# EAGLE design flying-horse-foot-v3.1 (EAGLE 9.6.2)
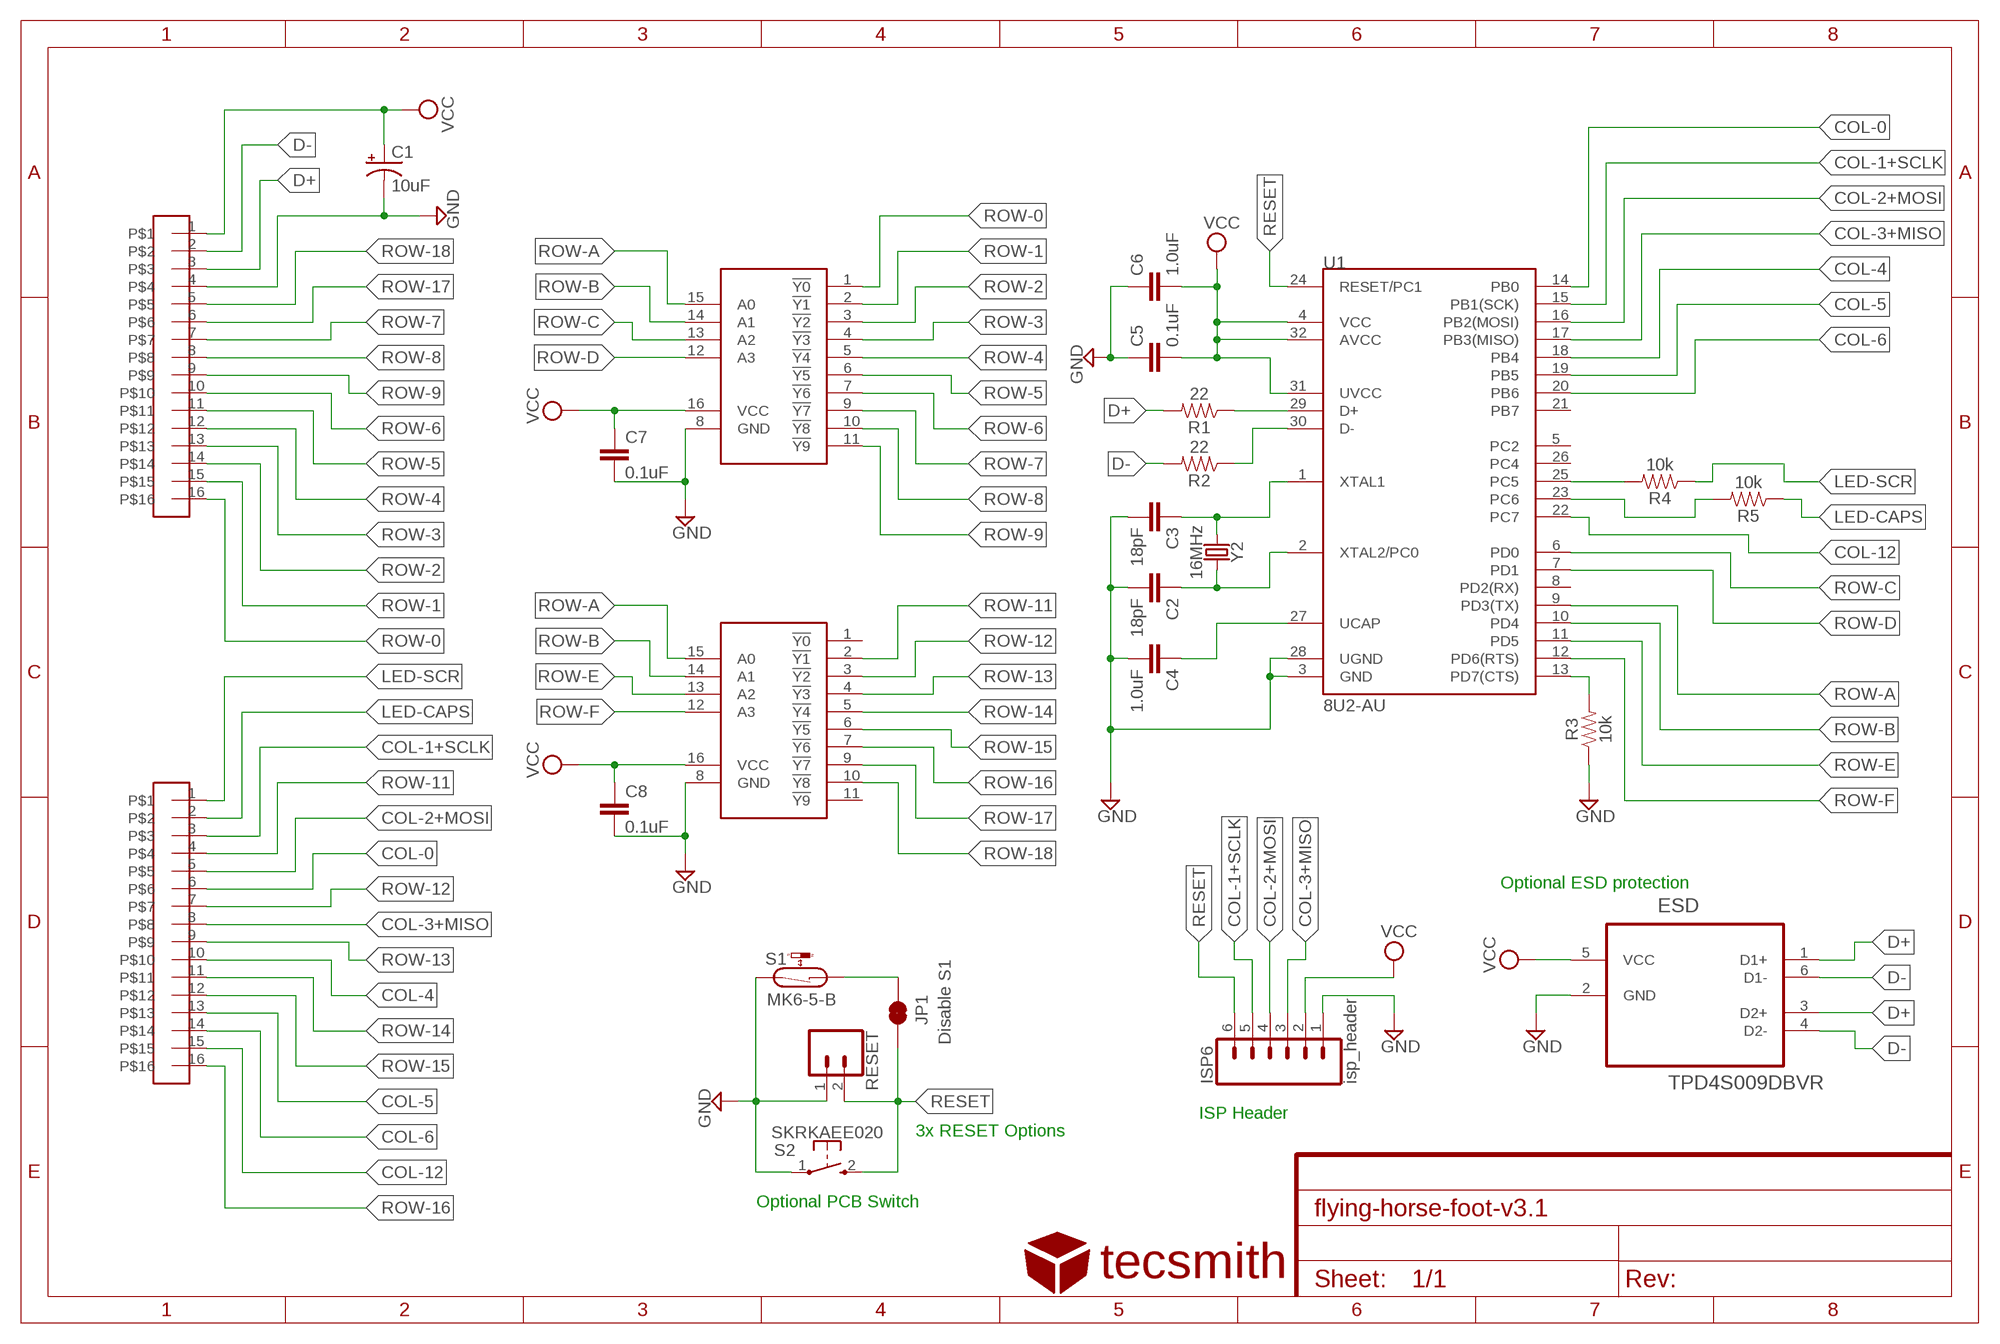
[diagram p0: schematic, sheet 1]

## Parts
C1  10uF  EEE-1CA100SR-EIA3528-20V-10%(TANT)  [EEE-1CA100SR]
C2  18pF  18PF-0603-50V-5%  [0603]
C3  18pF  18PF-0603-50V-5%  [0603]
C4  1.0uF  1.0UF-0603-16V-10%  [0603]
C5  0.1uF  0.1UF-0603-25V-5%  [0603]
C6  1.0uF  1.0UF-0603-16V-10%  [0603]
C7  0.1uF  0.1UF-0603-25V-5%  [0603]
C8  0.1uF  0.1UF-0603-25V-5%  [0603]
ESD  TPD4S009DBVR  [SOT95P280X145-6N]
ISP6  isp_header  CONN_06NO_SILK_NO_POP  [1X06_NO_SILK]
JP1  Disable S1  JUMPER-SMT_2_NC_TRACE_NO-SILK  [SMT-JUMPER_2_NC_TRACE_NO-SILK]
R1  22  22OHM-0603-1/10W-1%  [0603]
R2  22  22OHM-0603-1/10W-1%  [0603]
R3  10k  10KOHM-0603-1/10W-1%  [0603]
R4  10k  10KOHM-0603-1/10W-1%  [0603]
R5  10k  10KOHM-0603-1/10W-1%  [0603]
RESET  0.1 inch 2-pin  CONN_02  [1X02]
S1  MK6-5-B  REED-SWITCH-MK6-5-B  [MK6-5]
S2  SKRKAEE020  MOMENTARY-SWITCH-SPST-1  [SKRKAEE020]
U1  8U2-AU  ATMEGA8U2AU  [TQFP32-08_MCU]
U$1  SN74HC42DR  74HC42D16  [D16]
U$2  74HC42D16  [D16]
U$3  16PIN-2MM-HEADER  [16PIN-2MM-HEADER]
U$4  16PIN-2MM-HEADER  [16PIN-2MM-HEADER]
U$5  TECSMITH-LOGO  [TECSMITH-LOGO]
Y2  16MHz  CRYSTAL-16MHZSMD-5X3.2  [CRYSTAL-SMD-5X3.2-4PAD]

## Nets
COL-0: U1.14(PB0) U$4.6
COL-1+SCLK: ISP6.5 U1.15(PB1(SCK)) U$4.3
COL-2+MOSI: ISP6.4 U1.16(PB2(MOSI)) U$4.5
COL-3+MISO: ISP6.3 U1.17(PB3(MISO)) U$4.8
COL-4: U1.18(PB4) U$4.10
COL-5: U1.19(PB5) U$4.13
COL-6: U1.20(PB6) U$4.14
COL-12: U1.22(PC7) U$4.15
D+: ESD.1(D1+) ESD.3(D2+) R1.2 U$3.3
D-: ESD.4(D2-) ESD.6(D1-) R2.2 U$3.2
GND: C1.- C2.2 C3.2 C4.2 C5.1 C6.1 C7.2 C8.2 ESD.2(GND) ISP6.1 R3.1 RESET.1 S1.2 S2.1 U1.3(GND) U1.28(UGND) U$1.8(GND) U$2.8(GND) U$3.4
HWB: R3.2 U1.13(PD7(CTS))
LED-CAPS: R5.1 U$4.2
LED-SCR: R4.1 U$4.1
N$1: R1.1 U1.29(D+)
N$2: R2.1 U1.30(D-)
N$3: C2.1 U1.2(XTAL2/PC0) Y2.3
N$4: C3.1 U1.1(XTAL1) Y2.1
N$5: R4.2 U1.25(PC5)
N$6: C4.1 U1.27(UCAP)
N$7: R5.2 U1.23(PC6)
N$8: JP1.1 S1.1
RESET: ISP6.6 JP1.2 RESET.2 S2.2 U1.24(RESET/PC1)
ROW-0: U$1.1(!Y0) U$3.16
ROW-1: U$1.2(!Y1) U$3.15
ROW-2: U$1.3(!Y2) U$3.14
ROW-3: U$1.4(!Y3) U$3.13
ROW-4: U$1.5(!Y4) U$3.12
ROW-5: U$1.6(!Y5) U$3.11
ROW-6: U$1.7(!Y6) U$3.10
ROW-7: U$1.9(!Y7) U$3.7
ROW-8: U$1.10(!Y8) U$3.8
ROW-9: U$1.11(!Y9) U$3.9
ROW-11: U$2.2(!Y1) U$4.4
ROW-12: U$2.3(!Y2) U$4.7
ROW-13: U$2.4(!Y3) U$4.9
ROW-14: U$2.5(!Y4) U$4.11
ROW-15: U$2.6(!Y5) U$4.12
ROW-16: U$2.7(!Y6) U$4.16
ROW-17: U$2.9(!Y7) U$3.6
ROW-18: U$2.10(!Y8) U$3.5
ROW-A: U1.9(PD3(TX)) U$1.15(A0) U$2.15(A0)
ROW-B: U1.10(PD4) U$1.14(A1) U$2.14(A1)
ROW-C: U1.6(PD0) U$1.13(A2)
ROW-D: U1.7(PD1) U$1.12(A3)
ROW-E: U1.11(PD5) U$2.13(A2)
ROW-F: U1.12(PD6(RTS)) U$2.12(A3)
VCC: C1.+ C5.2 C6.2 C7.1 C8.1 ESD.5(VCC) ISP6.2 U1.4(VCC) U1.31(UVCC) U1.32(AVCC) U$1.16(VCC) U$2.16(VCC) U$3.1
Unconnected: U1.5(PC2) U1.8(PD2(RX)) U1.21(PB7) U1.26(PC4) U$2.1(!Y0) U$2.11(!Y9)

## Notes on the sheet
- Optional ESD protection
- ISP Header
- 3x RESET Options
- Optional PCB Switch

## Library data of the parts
C1 = aaa2:EEE-1CA100SR: 10.0µF polarized capacitors A capacitor is a passive two-terminal electrical component used to store electrical energy temporarily in an electric field.; PROD_ID: CAP-08063
C2 C3 = SparkFun-Capacitors:18PF: 18pF ceramic capacitors A capacitor is a passive two-terminal electrical component used to store electrical energy temporarily in an electric field.; PROD_ID: CAP-08267
C4 C6 = SparkFun-Capacitors:1.0UF: 1µF ceramic capacitors A capacitor is a passive two-terminal electrical component used to store electrical energy temporarily in an electric field.; PROD_ID: CAP-00868
C5 C7 C8 = SparkFun-Capacitors:0.1UF: 0.1µF ceramic capacitors A capacitor is a passive two-terminal electrical component used to store electrical energy temporarily in an electric field.; PROD_ID: CAP-08604
ESD = Texas Instruments_By_element14_Batch_1:TPD4S009DBVR: 4-CHANNEL ESD SOLUTION FOR HIGH-SPEED DIFFERENTIAL INTERFACE; MPN: TPD4S009DBVR; OC_FARNELL: 1855143; OC_NEWARK: 33R2191; PACKAGE: SOT-23-6; SUPPLIER: TEXAS INSTRUMENTS
ISP6 = SparkFun-Connectors:CONN_06: Multi connection point. Often used as Generic Header-pin footprint for 0.1 inch spaced/style header connections On any of the 0.1 inch spaced packages, you can populate with these: Break Away Headers - Straight <https://www.sparkfun.com/products/116> (PRT-00116) Break Away Male Headers - Right Angle <https://www.sparkfun.com/products/553> (PRT-00553) Female Headers <https://www.sparkfun.com/products/115> (PRT-00115) Break Away Headers - Machine Pin <https://www.sparkfun.com/products/117> (PRT-00117) Break Away Female Headers - Swiss Machine Pin <https://www.sparkfun.com/products/743> (PRT-00743) Arduino Stackable Header - 6 Pin <https://www.sparkfun.com/products/9280> (PRT-09280) For SCREWTERMINALS and SPRING TERMINALS visit here: Screw Terimnals on SparkFun.com <https://www.sparkfun.com/search/results?term=Screw+Terminals> (5mm/3.5mm/2.54mm spacing) This device is also useful as a general connection point to wire up your design to another part of your project. Our various solder wires solder well into these plated through hole pads. Hook-Up Wire - Assortment (Stranded, 22 AWG) <https://www.sparkfun.com/products/11375> (PRT-11375) Hook-Up Wire - Assortment (Solid Core, 22 AWG) <https://www.sparkfun.com/products/11367> (PRT-11367) View the entire wire category on our website here <https://www.sparkfun.com/categories/141>
JP1 = SparkFun-Jumpers:JUMPER-SMT_2_NC_TRACE: Normally closed trace jumper This jumper has a trace between two pads so it's normally closed (NC). Use a razor knife to open the connection. For best results follow the IPC guidelines for cutting traces: Cutout at least 0.063 mm (0.005 in). Remove all loose material to clean up the cut area. Seal the cut with an approved epoxy. Reapply solder to reclose the connection.
R1 R2 = SparkFun-Resistors:22OHM: 22Ω resistor A resistor is a passive two-terminal electrical component that implements electrical resistance as a circuit element. Resistors act to reduce current flow, and, at the same time, act to lower voltage levels within circuits. - Wikipedia; PROD_ID: RES-08698
R3-R5 = SparkFun-Resistors:10KOHM: 10kΩ resistor A resistor is a passive two-terminal electrical component that implements electrical resistance as a circuit element. Resistors act to reduce current flow, and, at the same time, act to lower voltage levels within circuits. - Wikipedia; PROD_ID: RES-00824
RESET = SparkFun-Connectors:CONN_02: Multi connection point. Often used as Generic Header-pin footprint for 0.1 inch spaced/style header connections On any of the 0.1 inch spaced packages, you can populate with these: Break Away Headers - Straight <https://www.sparkfun.com/products/116> (PRT-00116) Break Away Male Headers - Right Angle <https://www.sparkfun.com/products/553> (PRT-00553) Female Headers <https://www.sparkfun.com/products/115> (PRT-00115) Break Away Headers - Machine Pin <https://www.sparkfun.com/products/117> (PRT-00117) Break Away Female Headers - Swiss Machine Pin <https://www.sparkfun.com/products/743> (PRT-00743) For SCREWTERMINALS and SPRING TERMINALS visit here: Screw Terimnals on SparkFun.com <https://www.sparkfun.com/search/results?term=Screw+Terminals> (5mm/3.5mm/2.54mm spacing) This device is also useful as a general connection point to wire up your design to another part of your project. Our various solder wires solder well into these plated through hole pads. Hook-Up Wire - Assortment (Stranded, 22 AWG) <https://www.sparkfun.com/products/11375> (PRT-11375) Hook-Up Wire - Assortment (Solid Core, 22 AWG) <https://www.sparkfun.com/products/11367> (PRT-11367) View the entire wire category on our website here <https://www.sparkfun.com/categories/141> Special notes: Molex polarized connector foot print use with: PRT-08233 with associated crimp pins and housings. 2.54_SCREWTERM for use with PRT-10571. 3.5mm Screw Terminal footprints for PRT-08084 5mm Screw Terminal footprints for use with PRT-08432
S1 = switch-reed:REED-SWITCH-: Reed Sensor; MF: MEDER; MPN: MK6-5-B; OC_FARNELL: 1079479
S2 = SilvinoR_Custom_Eagle:MOMENTARY-SWITCH-SPST-1: Momentary Switch (Pushbutton) - SPST - Two Circuits Normally-open (NO) SPST momentary switches (buttons, pushbuttons). Schematic symbol includes two switch circuits. Variants SMD-4.6MMX2.8MM - 4.60mm x 2.80mm Tactile Momentary Button Switch - Used on SparkFun SAMD21 Mini Breakout <https://www.sparkfun.com/products/13664> SMD-5.2MM - Mini Pushbutton Switch - SMD <https://www.sparkfun.com/products/8720> - Used on Arduino Pro Mini <https://www.sparkfun.com/products/11114>
U1 = SparkFun-Retired:ATMEGA8U2: Atmel 32-pin 8-bit Microcontroller with 8/16/32K Bystes of ISP Flash and USB Controller. ATmega8U2, ATmega16U2, and ATmega32U2 Datasheet SparkFun Products Storefront component: ATMEGA8U2-AU <https://www.sparkfun.com/products/13703> (COM-13703); PROD_ID: IC-10104
U$1 U$2 = aaa2:74HC42
U$3 U$4 = aaa2:16PIN-2MM-HEADER
U$5 = SilvinoR_Custom_Eagle:TECSMITH-LOGO
Y2 = SparkFun-Clocks:CRYSTAL-16MHZ: 16MHz Crystal Digikey Example <http://www.digikey.com/product-search/en?keywords=535-9122-1-ND> Frequency: 16MHz Frequency Stability: ±50ppm Frequency Tolerance: ±20ppm Load Capacitance: 18pF SparkFun Products: Pro Micro -5V/16MHz <https://www.sparkfun.com/products/12640> SparkFun Serial Enabled LCD Kit <https://www.sparkfun.com/products/10097>; PROD_ID: XTAL-08218; SF_ID: COM-00094

## Board
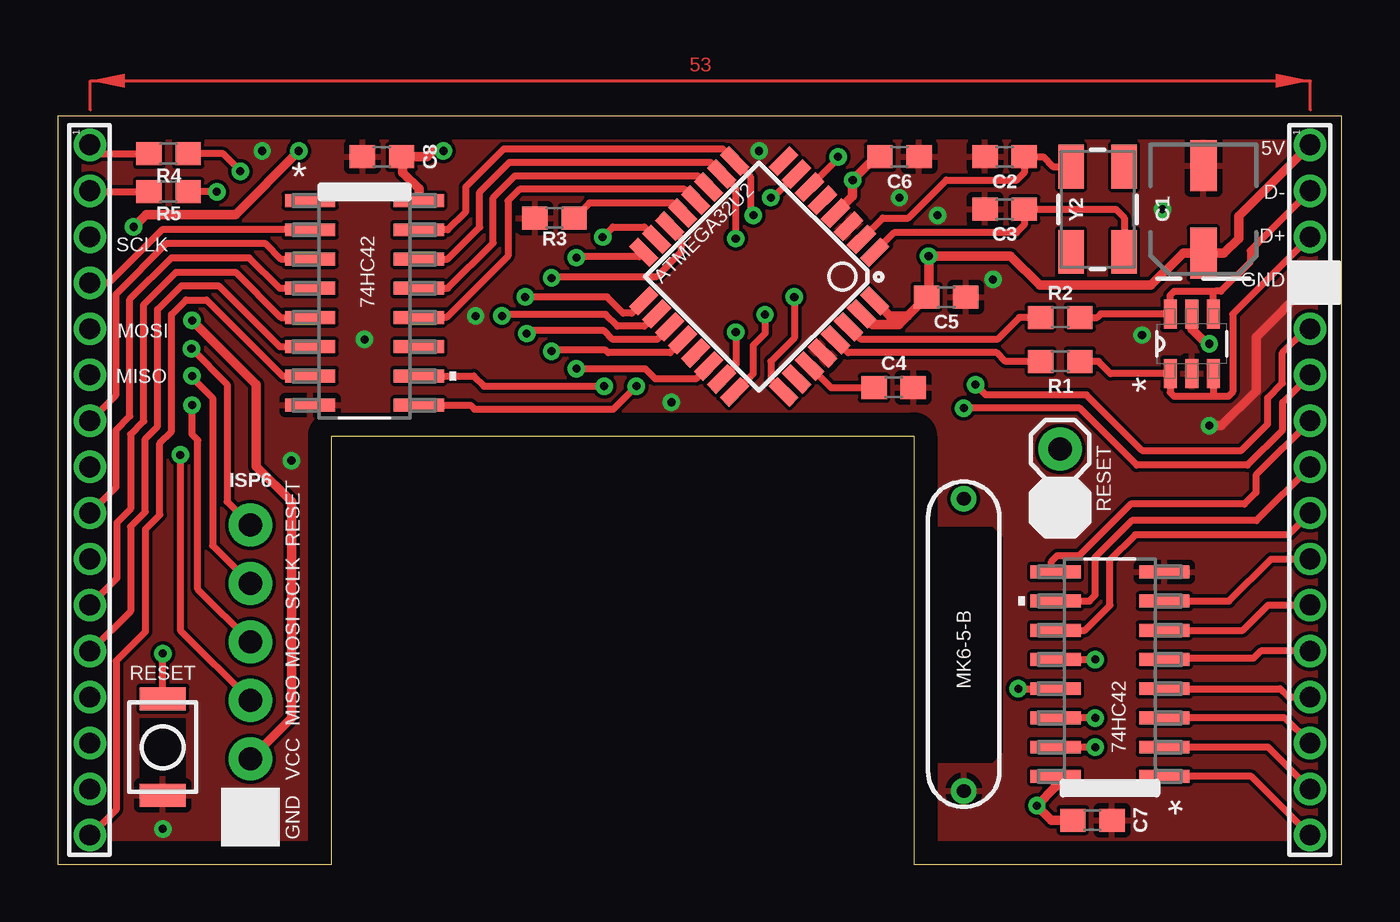
[diagram p1: board, top side]
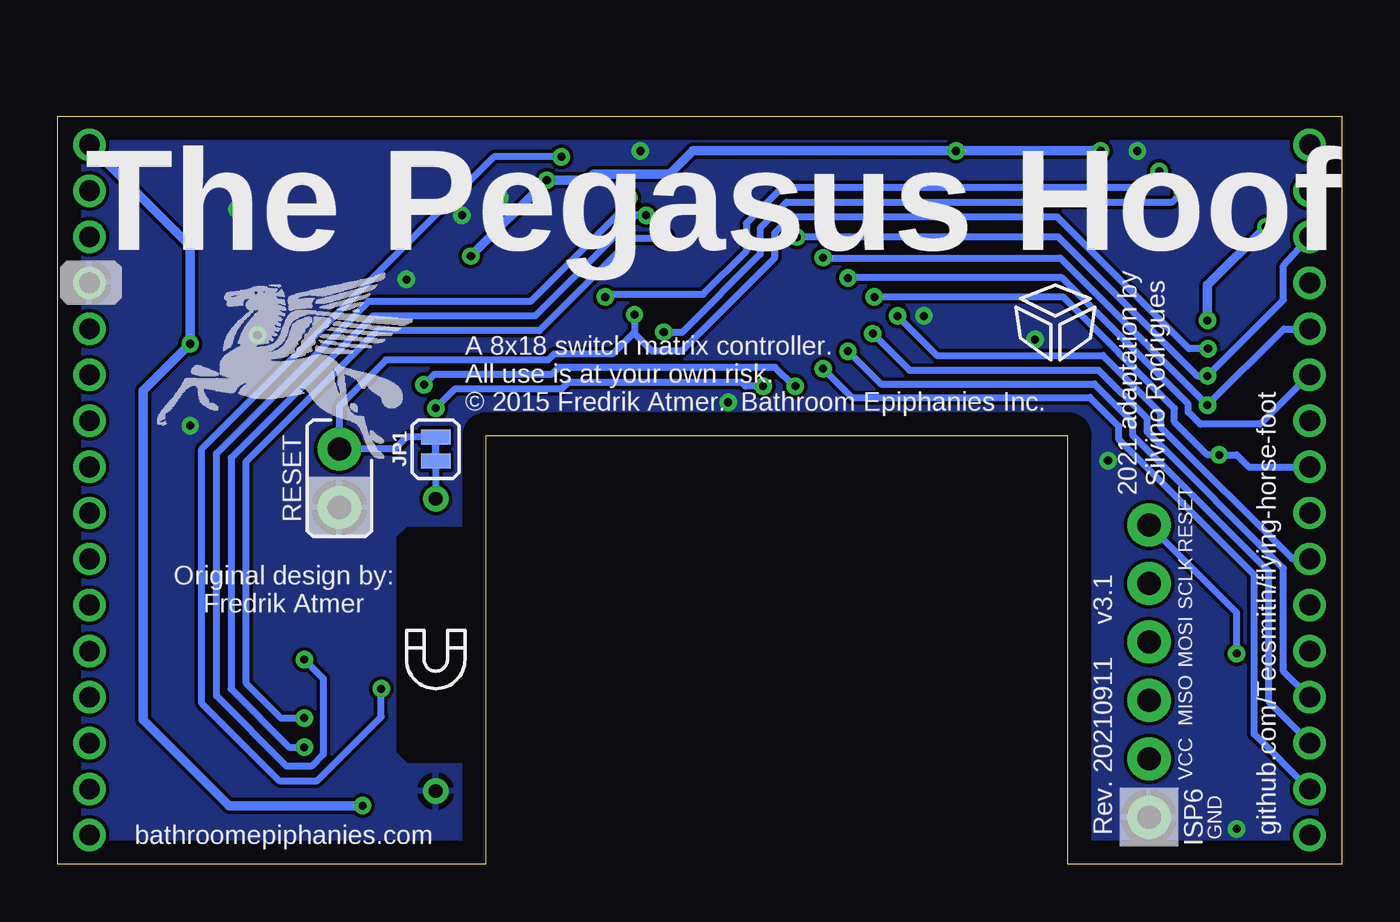
[diagram p2: board, bottom side, seen from below]

Size 55.8 x 32.5 mm. Coordinates in mm from the lower left corner, seen from the top.
Outline: 0,0 11.9,0 11.9,18.6 37.2,18.6 37.2,0 55.8,0 55.8,32.5 0,32.5 0,0
Copper layers (1*16): Top 0.035mm / dielectric 1.5mm / Bottom 0.035mm
Design rules "default": minimum track width 6mil, minimum drill 0.35mm, track to track 6mil, track to pad 6mil, pad to pad 6mil, via to via 6mil, smd to smd 6mil, copper to edge 40mil, drill to drill 6mil, minimum pad ring 10mil, minimum via ring 8mil, stop-mask expansion 4mil, vias tented up to drill 0mil, thermal gap 10mil

### Footprints (pad centres in the part's own frame; a part is rotated, then mirrored left to right if it is on the bottom)
EEE-1CA100SR = smd 1.15 x 2.2: + 0,-1.9; - 0,1.9
0603 = smd 1.1 x 1: 1 -0.85,0; 2 0.85,0
SOT95P280X145-6N = smd 1.27 x 0.559: 1 -1.295,0.94; 2 -1.295,0; 3 -1.295,-0.94; 4 1.295,-0.94; 5 1.295,0; 6 1.295,0.94
1X06_NO_SILK = drill 1.016 pad 1.88: 1 0,0; 2 2.54,0; 3 5.08,0; 4 7.62,0; 5 10.16,0; 6 12.7,0
SMT-JUMPER_2_NC_TRACE_NO-SILK = smd 0.66 x 1.27: 1 -0.521,0; 2 0.521,0
1X02 = drill 1.016 pad 1.88: 1 0,0; 2 2.54,0
MK6-5 = drill 0.6 pad 1.016: 1 -6.35,0; 2 6.35,0
SKRKAEE020 = smd 1 x 2: 1 -2.1,0; 2 2.1,0
TQFP32-08_MCU = smd 1.27 x 0.559: 1 -4.293,2.8; 2 -4.293,2; 3 -4.293,1.2; 4 -4.293,0.4; 5 -4.293,-0.4; 6 -4.293,-1.2; 7 -4.293,-2; 8 -4.293,-2.8; 17 4.293,-2.8; 18 4.293,-2; 19 4.293,-1.2; 20 4.293,-0.4; 21 4.293,0.4; 22 4.293,1.2; 23 4.293,2; 24 4.293,2.8 | smd 0.559 x 1.27: 9 -2.8,-4.293; 10 -2,-4.293; 11 -1.2,-4.293; 12 -0.4,-4.293; 13 0.4,-4.293; 14 1.2,-4.293; 15 2,-4.293; 16 2.8,-4.293; 25 2.8,4.293; 26 2,4.293; 27 1.2,4.293; 28 0.4,4.293; 29 -0.4,4.293; 30 -1.2,4.293; 31 -2,4.293; 32 -2.8,4.293
D16 = smd 2.184 x 0.559: 1 -2.362,4.445; 2 -2.362,3.175; 3 -2.362,1.905; 4 -2.362,0.635; 5 -2.362,-0.635; 6 -2.362,-1.905; 7 -2.362,-3.175; 8 -2.362,-4.445; 9 2.362,-4.445; 10 2.362,-3.175; 11 2.362,-1.905; 12 2.362,-0.635; 13 2.362,0.635; 14 2.362,1.905; 15 2.362,3.175; 16 2.362,4.445
16PIN-2MM-HEADER = drill 0.9 pad 1.27: 1 -15,-1; 2 -13,-1; 3 -11,-1; 4 -9,-1; 5 -7,-1; 6 -5,-1; 7 -3,-1; 8 -1,-1; 9 1,-1; 10 3,-1; 11 5,-1; 12 7,-1; 13 9,-1; 14 11,-1; 15 13,-1; 16 15,-1
CRYSTAL-SMD-5X3.2-4PAD = smd 1.9 x 1.1: 1 -1.85,-1.15; 2 1.85,-1.15; 3 1.85,1.15; 4 -1.85,1.15

### Placement (x,y rotation side)
C1  49.78,28.45 0 top
C2  41.15,30.73 180 top
C3  41.15,28.45 180 top
C4  36.32,20.7 0 top
C5  38.61,24.64 180 top
C6  36.58,30.73 180 top
C7  44.96,1.91 0 top
C8  14.1,30.73 180 top
ESD  49.28,22.61 90 top
ISP6  8.38,2.03 90 top
JP1  39.37,18.03 90 bottom
R1  43.56,21.84 0 top
R2  43.56,23.75 0 top
R3  21.59,28.07 0 top
R4  4.83,30.86 0 top
R5  4.83,29.21 0 top
RESET  43.56,15.49 90 top
S1  39.37,9.53 270 top
S2  4.57,5.08 90 top
U1  30.48,25.53 225 top
U$1  45.72,8.26 180 top
U$2  13.34,24.38 0 top
U$3  55.42,16.26 270 top
U$4  2.4,16.26 270 top
U$5  12.45,23.62 0 bottom
Y2  45.19,28.45 90 top

### Tracks (layer width: path | path; a pad name or v marks a point on that pad's centre or on a via)
COL-0  (via drill 0.35)
  Top 0.305: U1.14 26.6,27.7 27.11,27.18 27.11,26.61 26.04,25.53 21.53,25.53 v21.46,25.46
  Bottom 0.305: v21.46,25.46 21.45,25.48 12.18,25.48 6.68,19.98 6.68,19.64 6.16,19.11 3.56,19.11 1.41,21.26 U$4.6
COL-1+SCLK  (via drill 0.35)
  Top 0.305: U1.15 25.49,27.69 24.13,27.69 v23.69,27.24 | v5.84,21.21 5.84,21.14 6.73,20.26 6.73,13.84 ISP6.5
  Bottom 0.305: v23.69,27.24 23.67,27.26 12.33,27.26 6.29,21.21 v5.84,21.21 2.54,24.51 2.54,26 U$4.3
COL-2+MOSI  (via drill 0.35)
  Top 0.305: v22.54,26.35 22.58,26.39 25.27,26.39 U1.16 | v5.84,19.94 5.84,18.67 6.1,18.41 6.1,11.94 ISP6.4
  Bottom 0.305: v22.54,26.35 22.53,26.34 12.24,26.34 v5.84,19.94 2.52,23.26 U$4.5
COL-3+MISO  (via drill 0.35)
  Top 0.305: 25.38,24.38 U1.17 25.46,24.45 24.96,23.94 24.57,23.94 23.88,24.64 v20.32,24.64 | ISP6.3 5.33,10.16 v5.33,17.78
  Bottom 0.305: v20.32,24.64 12.11,24.64 7.27,19.8 7.27,19.21 5.84,17.78 v5.33,17.78 4.57,17.78 4.05,17.26 U$4.8
COL-4  (via drill 0.35)
  Top 0.305: U1.18 26.03,23.89 | 19.3,23.8 v19.3,23.81 19.37,23.88 23.81,23.88 24.32,23.37 25.49,23.37 U1.18 | U1.18 25.75,23.62
  Bottom 0.305: v19.3,23.81 17.59,22.1 10.38,22.1 7.86,19.57 7.86,18.97 2.16,13.27 1.41,13.27 U$4.10
COL-5  (via drill 0.35)
  Top 0.305: 26.29,23.04 U1.19 26.05,22.8 24.12,22.8 23.74,23.17 20.54,23.17 20.4,23.04 v20.38,23.05
  Bottom 0.305: v20.38,23.05 18.8,21.46 10.58,21.46 8.46,19.35 8.46,18.77 2.54,12.85 2.54,8.38 1.41,7.26 U$4.13
COL-6  (via drill 0.35)
  Top 0.305: U1.20 26.61,22.23 23.92,22.23 23.81,22.33 21.51,22.33 v21.46,22.29
  Bottom 0.305: v21.46,22.29 20.04,20.86 10.75,20.86 9.07,19.18 9.07,18.61 3.17,12.71 3.17,7.05 1.4,5.27 U$4.14
COL-12  (via drill 0.35)
  Top 0.305: U1.22 27.73,21.08 25.97,21.08 25.54,21.51 22.55,21.51 v22.54,21.53
  Bottom 0.305: v22.54,21.53 21.29,20.28 10.94,20.28 9.68,19.02 9.68,18.45 3.81,12.57 3.81,5.65 1.39,3.23 U$4.15
D+
  Top 0.305: R1.2 45.22,21.84 45.74,21.31 ESD.1 48.34,20.5 48.51,20.32 50.23,20.32 | U$3.3 51.05,23.89 51.05,20.51 50.86,20.32 50.23,20.32 | ESD.3 50.22,20.33 50.23,20.32
D-
  Top 0.305: U$3.2 51.82,26.65 51.82,26.16 50.55,24.89 50.29,24.89 | R2.2 45.17,23.75 45.33,23.9 ESD.6 48.34,24.71 48.51,24.89 50.29,24.89 | ESD.4 50.22,24.82 50.29,24.89
GND  (via drill 0.35)
  Top 0.305: 33.23,22.2 U1.28
  Top 0.406: 13.18,30.8 C8.2 13.34,30.65 | U1.3 34.38,27.71 | U$2.8 10.72,19.94 | U$3.4 52.07,22.91 52.07,20.55 50.57,19.05 v50.04,19.05
  Bottom 0.305: v10.16,17.53 10.14,17.51
  other vias: 38.23,28.19 36.58,28.96 13.34,22.8 18.16,23.81 47.12,22.99 40.64,25.4 26.67,20.07 8.89,30.99 4.57,1.52 48.01,28.45 30.48,30.99
  pour Bottom: 0.13,0.13 11.75,0.13 11.75,18.8 37.4,18.8 37.4,15.18 37.85,14.73 40.64,14.73 41.15,14.22 41.15,4.83 40.64,4.32 37.85,4.32 37.4,3.87 37.4,0.13 55.69,0.13 55.69,32.38 0.13,32.38
  pour Top: 0.13,0.13 11.75,0.13 11.75,18.8 37.4,18.8 37.4,15.18 37.85,14.73 40.64,14.73 41.15,14.22 41.15,4.83 40.64,4.32 37.85,4.32 37.4,3.87 37.4,0.13 55.69,0.13 55.69,32.38 0.13,32.38
HWB
  Top 0.305: U1.13 27.16,28.29 26.73,28.73 23.1,28.73 R3.2
LED-CAPS
  Top 0.305: U$4.2 1.48,29.26 1.52,29.21 R5.1
LED-SCR
  Top 0.305: R4.1 1.78,30.86 1.4,31.24 U$4.1
N$1
  Top 0.305: R1.1 41.19,21.84 40.81,22.23 34.35,22.23 U1.29
N$2
  Top 0.305: U1.30 34.91,22.8 40.83,22.8 41.78,23.75 R2.1
N$3
  Top 0.305: U1.2 35.85,28.07 36.96,28.07 38.61,29.72 41.68,29.72 42,30.04 C2.1 42.82,30.73 43.27,30.29 44.03,30.29 Y2.3
N$4
  Top 0.305: U1.1 36.34,27.43 41.66,27.43 42,27.77 C3.1 45.97,28.45 46.34,28.09 Y2.1
N$5  (via drill 0.35)
  Top 0.305: R4.2 7.2,30.86 7.94,30.12 v7.94,30.1 | U1.25 30.99,21.06 30.99,21.84 32,22.86 v32,24.64
  Bottom 0.305: v7.94,30.1 8.64,29.4 24.32,29.4 25.88,27.84 25.88,26.64 27.75,24.77 31.88,24.77 v32,24.64
N$6
  Top 0.305: U1.27 33.61,20.7 C4.1
N$7  (via drill 0.35)
  Top 0.305: v6.92,29.21 R5.2 | v29.46,23.11 29.46,21.68 U1.23
  Bottom 0.305: v29.46,23.11 28.65,23.11 25.27,26.49 25.27,27.62 24.13,28.77 7.37,28.77 v6.92,29.21
N$8
  Bottom 0.305: JP1.1 S1.1
RESET  (via drill 0.35)
  Top 0.305: v30.73,23.88 30.73,23.05 30.23,22.54 30.23,21.31 U1.24 | v5.82,22.39 7.37,20.84 7.37,15.75 ISP6.6 | S2.2 v4.57,9.14
  Bottom 0.305: JP1.2 40.63,18.55 41.15,18.03 RESET.2 43.56,19.88 41.53,21.91 34.48,21.91 34.23,22.16 31.69,22.16 30.73,23.11 v30.73,23.88 30.73,23.05 29.97,22.29 28.7,22.29 24.64,26.35 24.64,27.43 23.94,28.13 12.38,28.13 6.64,22.39 v5.82,22.39 | v4.57,9.14 4.57,10.92 ISP6.6
ROW-0
  Top 0.305: U$3.16 51.86,3.81 U$1.1
ROW-1
  Top 0.305: U$3.15 52.59,5.08 U$1.2
ROW-2
  Top 0.305: U$3.14 53.32,6.35 U$1.3
ROW-3
  Top 0.305: U$1.4 53.12,7.62 53.48,7.26 U$3.13
ROW-4
  Top 0.305: U$1.5 48.13,8.94 51.96,8.94 52.28,9.26 U$3.12
ROW-5
  Top 0.305: U$1.6 51.5,10.16 52.59,11.26 U$3.11
ROW-6
  Top 0.305: U$1.7 50.9,11.43 52.72,13.26 U$3.10
ROW-7
  Top 0.305: U$1.9 43.18,12.88 43.18,13.14 43.43,13.4 44.39,13.4 46.62,15.64 51.56,15.64 52.06,16.14 52.06,16.9 U$3.7
ROW-8
  Top 0.305: U$1.10 44.83,11.43 45.09,11.68 45.09,13.34 46.67,14.92 52.08,14.92 U$3.8
ROW-9
  Top 0.305: U$1.11 44.64,10.16 45.72,11.24 45.72,13.21 46.82,14.3 53.47,14.3 U$3.9
ROW-11
  Top 0.305: U$4.4 2.24,25.26 4.54,27.56 U$2.2
ROW-12
  Top 0.305: U$4.7 1.41,19.26 2.54,20.38 2.54,24.77 4.75,26.98 9.02,26.98 9.7,26.29 U$2.3
ROW-13
  Top 0.305: U$4.9 1.41,15.26 2.54,16.38 2.54,18.86 3.14,19.46 3.14,24.54 4.94,26.34 8.33,26.34 9.65,25.02 U$2.4
ROW-14
  Top 0.305: U$4.11 1.41,11.26 2.57,12.41 2.57,14.83 3.17,15.43 3.17,18.67 3.75,19.24 3.75,24.32 5.14,25.72 7.73,25.72 9.7,23.75 U$2.5
ROW-15
  Top 0.305: U$4.12 1.45,9.26 3.17,10.99 3.17,14.67 3.81,15.3 3.81,18.48 4.35,19.02 4.35,24.1 5.38,25.13 7,25.13 9.65,22.48 U$2.6
ROW-16
  Top 0.305: U$4.16 1.45,1.26 2.54,2.35 2.54,8.83 3.81,10.1 3.81,14.54 4.45,15.18 4.45,18.29 4.95,18.8 4.95,23.88 5.59,24.51 6.48,24.51 9.78,21.21 U$2.7
ROW-17  (via drill 0.35)
  Top 0.305: U$2.9 17.94,19.94 18.11,19.77 24.15,19.77 v25.15,20.77 | U$3.6 53.22,20.06 53.22,18.87 51.69,17.34 46.88,17.34 44.41,19.81 v39.37,19.81
  Bottom 0.305: v39.37,19.81 38.54,20.64 33.91,20.64 33.59,20.95 26.1,20.95 25.91,20.77 v25.15,20.77
ROW-18  (via drill 0.35)
  Top 0.305: U$2.10 18.08,21.21 18.53,20.77 v23.75,20.77 | U$3.5 54.24,23.26 53.21,22.23 53.21,20.89 52.58,20.26 52.58,19.11 51.44,17.97 47.12,17.97 44.7,20.38 40.32,20.38 v39.88,20.83
  Bottom 0.305: v23.75,20.77 23.81,20.77 24.62,21.58 34.04,21.58 34.34,21.27 39.43,21.27 v39.88,20.83
ROW-A  (via drill 0.35)
  Top 0.305: U$2.15 16.95,27.56 17.75,28.35 17.75,29.43 19.39,31.08 28.89,31.08 U1.9 30.1,29.87 30.1,28.32 v30.23,28.19 | v45.09,5.08 U$1.15
  Bottom 0.305: v30.23,28.19 30.67,28.19 35.05,23.81 42.1,23.81 48.26,17.65 48.26,7.61 45.73,5.08 v45.09,5.08
ROW-B  (via drill 0.35)
  Top 0.305: v29.46,27.18 29.46,29.37 U1.10 28.86,30.01 28.37,30.49 19.64,30.49 18.34,29.2 18.34,27.67 16.95,26.29 U$2.14 | v45.09,6.35 U$1.14
  Bottom 0.305: v29.46,27.18 30.86,27.18 34.86,23.18 41.91,23.18 47.62,17.46 47.62,7.87 46.1,6.35 v45.09,6.35
ROW-C  (via drill 0.35)
  Top 0.305: v33.91,30.73 33.91,30.65 U1.6 | 43.31,7.67 U$1.13 v41.73,7.62
  Bottom 0.305: v33.91,30.73 36.83,30.73 49.53,18.03 49.53,6.99 46.16,3.62 44.51,3.62 41.73,6.4 v41.73,7.62
ROW-D  (via drill 0.35)
  Top 0.305: U1.7 31.08,28.96 v30.99,28.96 | U$1.12 v45.09,8.89
  Bottom 0.305: v30.99,28.96 30.99,28.7 35.24,24.45 42.29,24.45 48.9,17.84 48.9,7.3 45.85,4.25 44.77,4.25 44.26,4.76 44.26,8.06 v45.09,8.89
ROW-E
  Top 0.305: U1.11 28.29,29.42 27.81,29.91 19.88,29.91 18.92,28.96 18.92,26.99 16.95,25.02 U$2.13
ROW-F
  Top 0.305: U1.12 27.25,29.32 20.07,29.32 19.57,28.82 19.57,26.43 16.89,23.75 U$2.12
VCC  (via drill 0.35)
  Top 0.305: 35.73,30.59 C6.2 | 34.9,23.91 U1.31
  Top 0.406: C5.2 37.85,24.73 v37.85,26.42 41.4,26.42 42.67,25.15 47.5,25.15 48.9,26.55 C1.+ 50.68,26.55 51.31,27.18 51.31,28.15 U$3.1 | C5.2 37.73,24.66 | C6.2 35.56,30.73 v34.54,29.72 34.54,29.02 U1.4 | ESD.5 49.28,23.24 49.91,22.61 v50.04,22.61 | v16.76,30.99 16.32,30.99 16.07,30.73 C8.1 14.99,30.7 14.99,30.05 15.7,29.34 U$2.16 | v5.84,23.62 8.64,20.83 8.64,17.27 10.16,15.75 10.16,6.35 ISP6.2 | C7.1 43.18,1.91 v42.55,2.54 43.36,3.35 U$1.16 | v3.3,27.69 3.84,28.23 7.74,28.23 10.48,30.97 v10.48,30.99 | U1.32 36.15,23.81 36.93,23.81 | 36.93,23.81 C5.2 | U1.31 35.4,23.43 36.55,23.43 36.93,23.81
  Bottom 0.406: U$3.1 54.42,31.24 50.04,26.86 v50.04,22.61 52.07,20.57 52.07,6.27 48.34,2.54 v42.55,2.54 | v37.85,26.42 v34.54,29.72 32.77,29.72 32.51,29.97 29.21,29.97 28.19,30.99 v16.76,30.99 v10.48,30.99 | v3.3,27.69 5.84,25.15 v5.84,23.62
(copper drawn outside any net)
  shapes: Top area x1

### Text on the board
tPlace: 5V | D- | SCLK | 74HC42 | D+ | ATMEGA32U2 | GND | MOSI | MISO | RESET | MK6-5-B | 74HC42
tNames: RESET | SCLK | MOSI | RESET | MISO | VCC | GND
bNames: The Pegasus Hoof | 2021 adaptation by / Silvino Rodrigues | A 8x18 switch matrix controller. / All use is at your own risk. / © 2015 Fredrik Atmer. Bathroom Epiphanies Inc. | RESET | RESET | SCLK | Original design by: / Fredrik Atmer | MOSI | v3.1 | MISO | VCC | GND | ISP6 | github.com/Tecsmith/flying-horse-foot | Rev. 20210911 | bathroomepiphanies.com